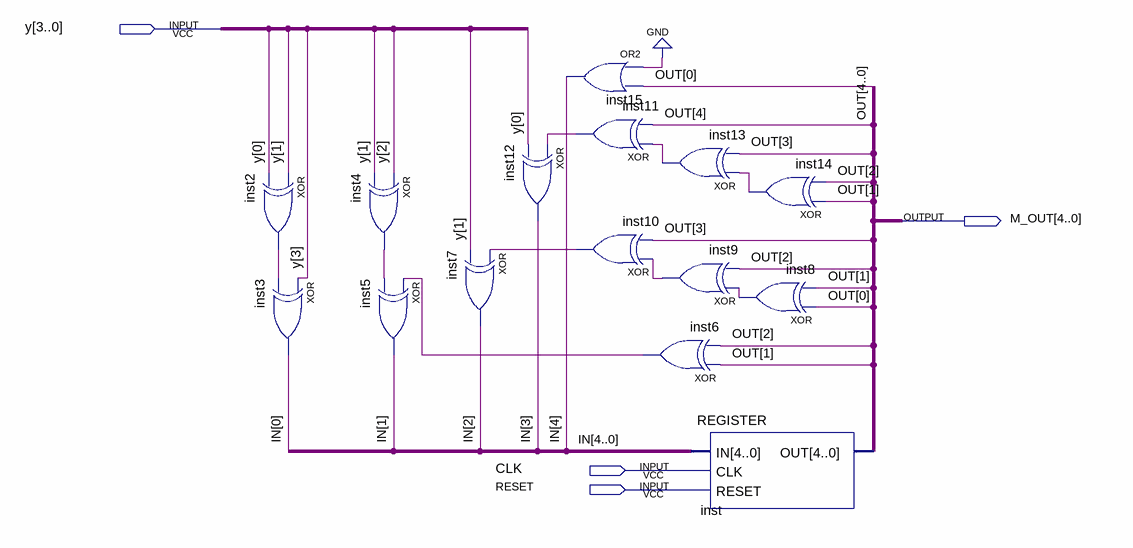
[diagram p0: schematic sheet]
// Quartus schematic Signature_analyzer.bdf as structural Verilog: 15 symbols, 4 pins
module Signature_analyzer (
  input  [3:0] y,
  input  CLK,
  input  RESET,
  output [4:0] M_OUT
);

  wire inst2_out, inst4_out, inst6_out, inst8_out, inst9_out, inst10_out, inst11_out, inst13_out, inst14_out;
  wire [4:0] IN;

  xor inst2 (inst2_out, y[1], y[0]);
  xor inst3 (IN[0], y[3], inst2_out);
  xor inst4 (inst4_out, y[2], y[1]);
  xor inst5 (IN[1], inst6_out, inst4_out);
  xor inst7 (IN[2], inst10_out, y[1]);
  or inst15 (IN[4], 1'b0, M_OUT[0]);
  xor inst11 (inst11_out, inst13_out, M_OUT[4]);
  xor inst12 (IN[3], inst11_out, y[0]);
  xor inst10 (inst10_out, inst9_out, M_OUT[3]);
  xor inst6 (inst6_out, M_OUT[1], M_OUT[2]);
  xor inst13 (inst13_out, inst14_out, M_OUT[3]);
  xor inst9 (inst9_out, inst8_out, M_OUT[2]);
  REGISTER inst (.IN(IN), .CLK(CLK), .RESET(RESET), .OUT(M_OUT));
  xor inst14 (inst14_out, M_OUT[1], M_OUT[2]);
  xor inst8 (inst8_out, M_OUT[0], M_OUT[1]);

  // Other names for the same wires on the sheet: OUT[4:0] = M_OUT
endmodule
